# EAGLE design Timer_UNO (EAGLE 6.4)
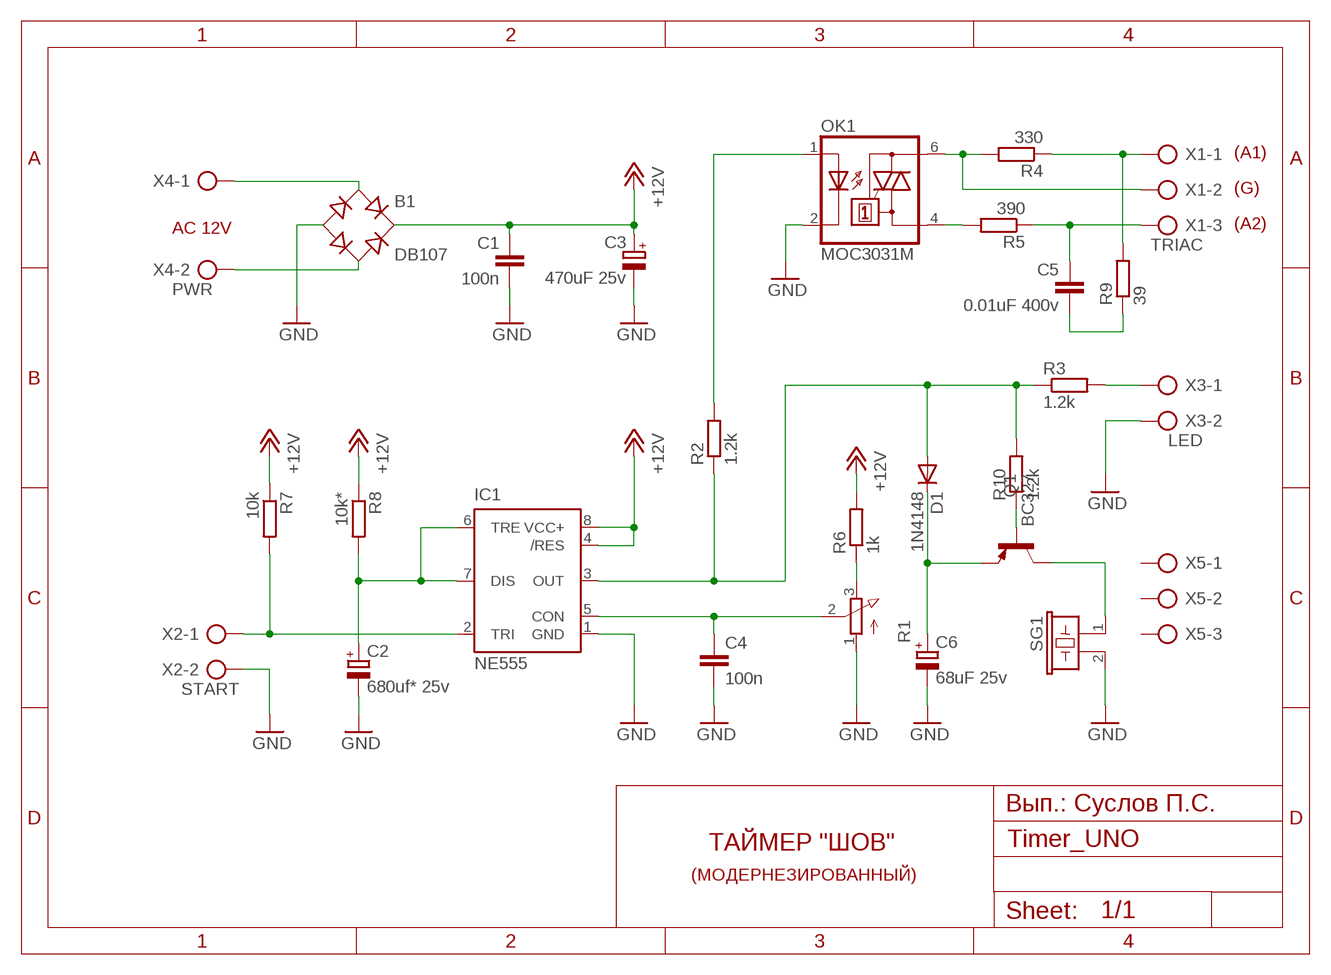
[diagram p0: schematic, sheet 1]

## Parts
B1  DB107  DBDB107G  [DB]
C1  100n  C-EU025-030X050  [C025-030X050]
C2  680uf* 25v  CPOL-EUE3.5-10  [E3,5-10]
C3  470uF 25v  CPOL-EUE3.5-8  [E3,5-8]
C4  100n  C-EU025-030X050  [C025-030X050]
C5  0.01uF 400v  C-EU075-063X106  [C075-063X106]
C6  68uF 25v  CPOL-EUE3.5-8  [E3,5-8]
D1  1N4148  1N4148DO35-7  [DO35-7]
IC1  NE555  [DIL-08]
OK1  MOC3031M  [DIL06]
Q1  BC327  [TO92-EBC]
R1  3RP/1610N  [3RP/1610N]
R2  1.2k  R-EU_0207/10  [0207/10]
R3  1.2k  R-EU_0207/10  [0207/10]
R4  330  R-EU_0207/10  [0207/10]
R5  390  R-EU_0207/10  [0207/10]
R6  1k  R-EU_0207/10  [0207/10]
R7  10k  R-EU_0207/10  [0207/10]
R8  10k*  R-EU_0207/10  [0207/10]
R9  39  R-EU_0411/12  [0411/12]
R10  1.2k  R-EU_0207/10  [0207/10]
SG1  EFBAA40D101  [EFBAA40D101]
X1  TRIAC  AK500/3  [AK500/3]
X2  START  AK500/2  [AK500/2]
X3  LED  AK500/2  [AK500/2]
X4  PWR  AK500/2  [AK500/2]
X5  AK500/3  [AK500/3]

## Nets
+12V: B1.+ C1.1 C3.+ IC1.4(/RES) IC1.8(VCC+) R6.2 R7.1 R8.1
GND: B1.- C1.2 C2.- C3.- C4.2 C6.- IC1.1(GND) OK1.2(C) R1.1(A) SG1.2 X2.2 X3.2
N$1: C4.1 IC1.5(CON) R1.2(S)
N$2: D1.A IC1.3(OUT) R2.1 R3.1 R10.2
N$3: R3.2 X3.1
N$4: OK1.1(A) R2.2
N$5: C5.1 R5.1 X1.3
N$6: OK1.4(A1) R5.2
N$7: OK1.6(A2) R4.2 X1.2
N$8: R4.1 R9.2 X1.1
N$9: R1.3(E) R6.1
N$10: IC1.2(TRI) R7.2 X2.1
N$11: C2.+ IC1.6(TRE) IC1.7(DIS) R8.2
N$12: B1.AC2 X4.2
N$13: B1.AC1 X4.1
N$15: C5.2 R9.1
N$34: C6.+ D1.C Q1.E
N$35: Q1.B R10.1
N$36: Q1.C SG1.1
Unconnected: X5.1 X5.2 X5.3

## Notes on the sheet
- (A1)
- (G)
- AC 12V | (A2)
- Вып.: Суслов П.С.
- ТАЙМЕР "ШОВ"
- (МОДЕРНЕЗИРОВАННЫЙ)

## Library data of the parts
B1 = rectifier:DB?*G: Single Phase 1.0 AMP Glass Passivated Bridge Rectifier Taiwan Semiconductor Co.,Ltd. - TSC Source: http://www.taiwansemi.com/TSCbig5/ezcatfiles/cust/img/img/db101g.pdf http://www.ts.com.tw/db/pictures/modules/PDT/PDT060207001/DBLS201G.pdf
C1 C4 C5 = rcl:C-EU: CAPACITOR, European symbol
C2 C3 C6 = rcl:CPOL-EU: POLARIZED CAPACITOR, European symbol
D1 = diode:1N4148: DIODE high speed (Philips)
IC1 = st-microelectronics:NE555: General purpose bipolar Timer; MF: Arrow Electronics; MPN: NE555N; OC_FARNELL: 1467742; OC_NEWARK: 89K1486
OK1 = optocoupler:MOC30*: 6-Pin DIP Zero-Cross Optoisolators Triac Driver Output (250/400 Volt Peak) Source: Data sheet <http://www.fairchildsemi.com/ds/MO/MOC3031M.pdf> The old path of data sheet not more available 2013-05-06.; MF: FAIRCHILD SEMICONDUCTOR; MPN: MOC3031M; OC_FARNELL: 9875964; OC_NEWARK: 78K6089
Q1 = transistor-pnp:BC327*: PNP Transistror
R1 = pot:3RP/1610N: 16mm Potentiometer one level Source: http://www.alphapotentiometers.net/html/16mm_pot_2.html
R2-R10 = rcl:R-EU_: RESISTOR, European symbol
SG1 = buzzer:EFB?: Piezoelectric Acoustic Transducer Source: Panbasonic .. 2SC1685.pdf; OC_FARNELL: unknown; OC_NEWARK: unknown
X1 X5 = con-ptr500:AK500/3: CONNECTOR; OC_FARNELL: unknown; OC_NEWARK: unknown
X2-X4 = con-ptr500:AK500/2: CONNECTOR; OC_FARNELL: unknown; OC_NEWARK: unknown

## Board
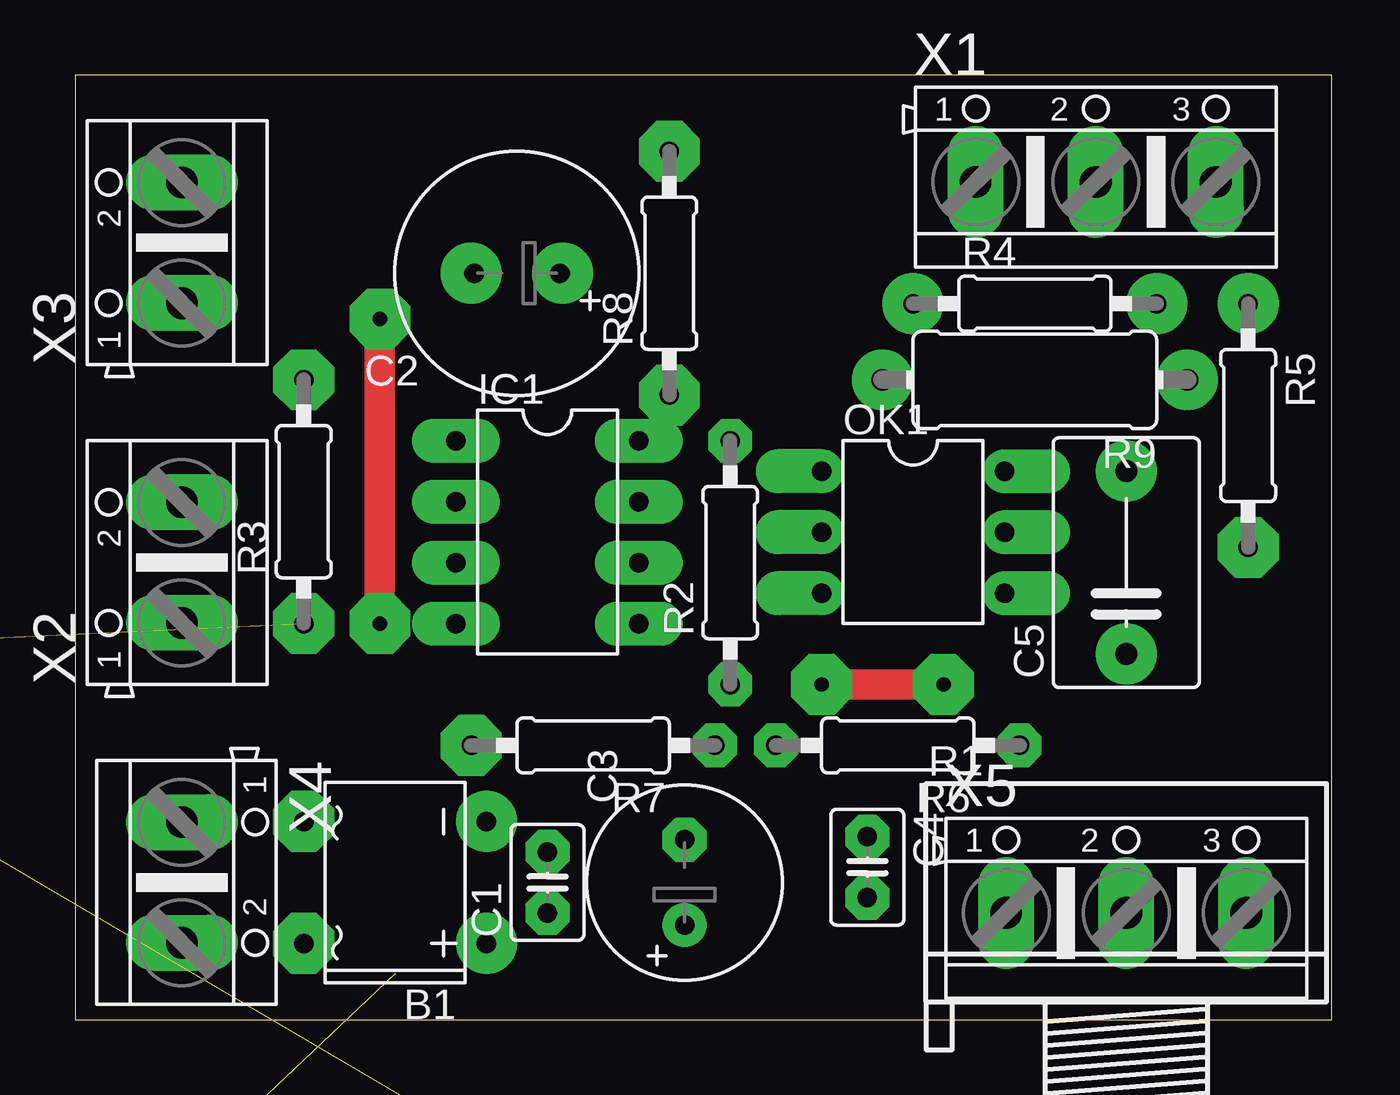
[diagram p1: board, top side]
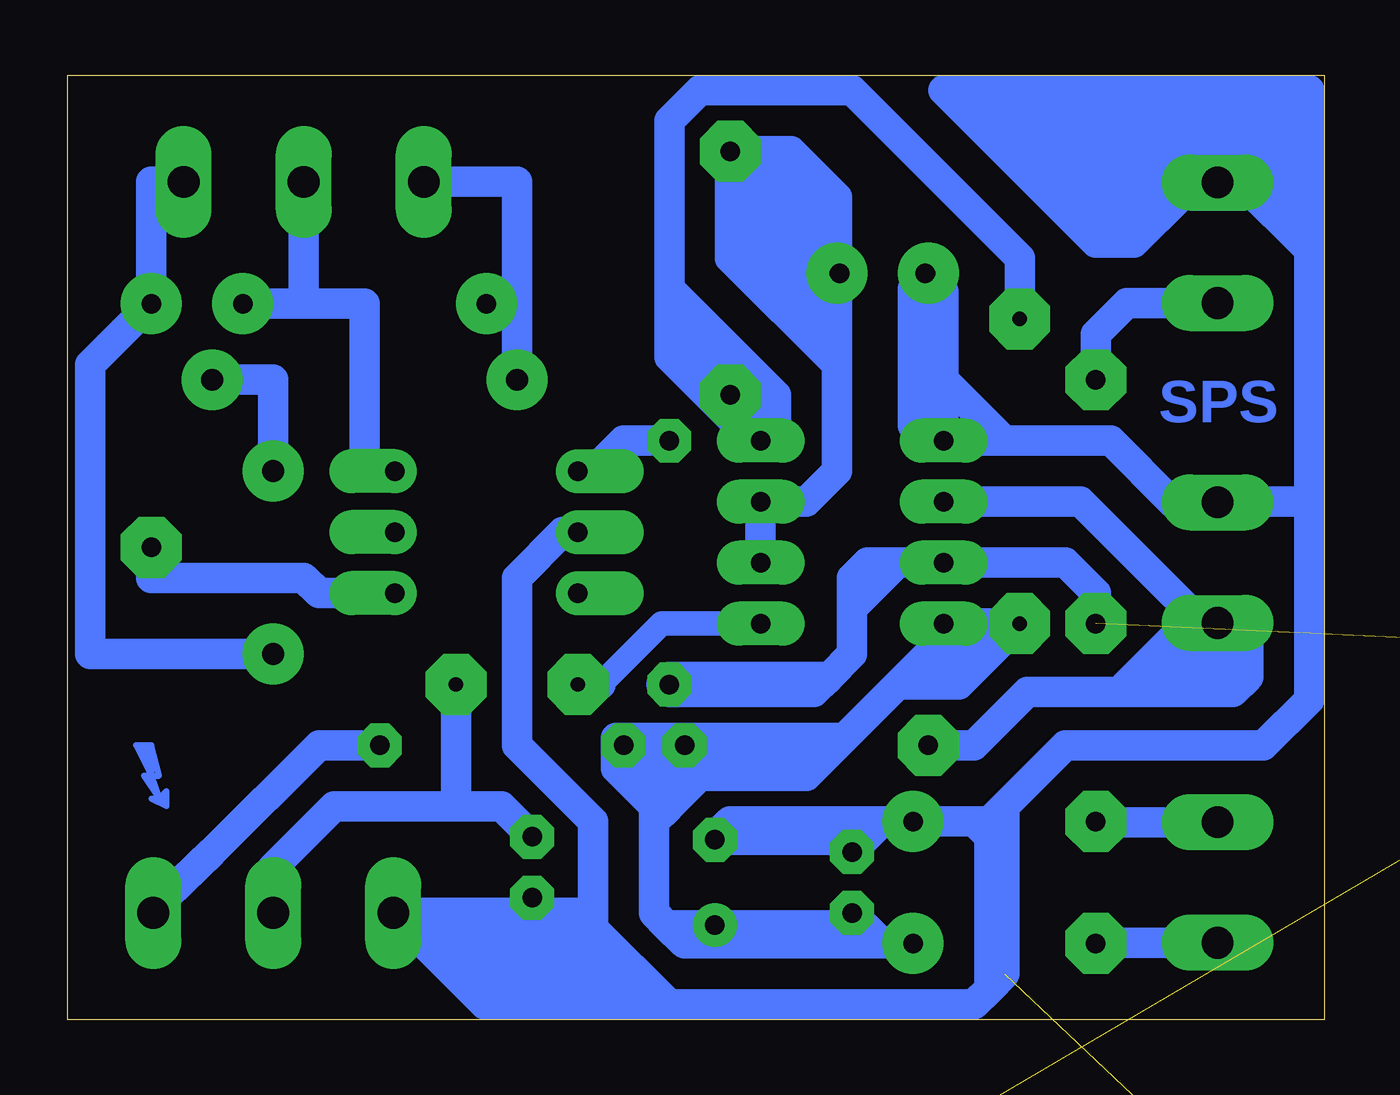
[diagram p2: board, bottom side, seen from below]

Size 52.38 x 39.36 mm. Coordinates in mm from the lower left corner, seen from the top.
Outline: 0,0 52.38,0 52.38,39.36 0,39.36 0,0
Copper layers (1*16): Top 0.035mm / dielectric 1.5mm / Bottom 0.035mm
Design rules "default *": minimum track width 10mil, minimum drill 24mil, track to track 8mil, track to pad 8mil, pad to pad 8mil, via to via 8mil, smd to smd 8mil, copper to edge 40mil, drill to drill 8mil, minimum pad ring 20mil, minimum via ring 8mil, stop-mask expansion 4mil, vias tented up to drill 0mil, thermal gap 10mil
tKeepout: 5 lines

### Footprints (pad centres in the part's own frame; a part is rotated, then mirrored left to right if it is on the bottom)
DB = drill 0.813: + -2.54,-3.81 | drill 0.813 octagon: - 2.54,-3.81; AC1 2.54,3.81; AC2 -2.54,3.81
C025-030X050 = drill 0.813 octagon: 1 -1.27,0; 2 1.27,0
E3,5-10 = drill 0.813 pad 1.6: + -1.778,0 | drill 0.813 pad 1.6 octagon: - 1.778,0
E3,5-8 = drill 0.813 pad 1.6: + -1.778,0 | drill 0.813 pad 1.6 octagon: - 1.778,0
C075-063X106 = drill 0.914 octagon: 1 -3.81,0; 2 3.81,0
DO35-7 = drill 0.813 long: A 3.81,0; C -3.81,0
DIL-08 = drill 0.813 long: 1 -3.81,-3.81; 2 -1.27,-3.81; 3 1.27,-3.81; 4 3.81,-3.81; 5 3.81,3.81; 6 1.27,3.81; 7 -1.27,3.81; 8 -3.81,3.81
DIL06 = drill 0.813 offset: 1 -2.54,-3.81; 2 0,-3.81; 3 2.54,-3.81; 4 2.54,3.81; 5 0,3.81; 6 -2.54,3.81
TO92-EBC = drill 0.813 long: B 0,-1.27; C -2.54,-1.27; E 2.54,-1.27
3RP/1610N = drill 1.2 pad 2.184: 1 -5,0; 2 0,0; 3 5,0
0207/10 = drill 0.813 octagon: 1 -5.08,0; 2 5.08,0
0411/12 = drill 0.914 octagon: 1 -6.35,0; 2 6.35,0
EFBAA40D101 = drill 1.1 pad 1.676: 1 -5,0; 2 5,0
AK500/3 = drill 1.321 long: 1 -5.004,0; 2 0,0; 3 5.004,0
AK500/2 = drill 1.321 long: 1 -2.515,0; 2 2.515,0

### Placement (x,y rotation side)
B1  13.34,5.71 90 top
C1  19.68,5.71 90 top
C2  18.41,31.11 180 top
C3  25.4,5.71 90 top
C4  33.02,6.35 270 top
C5  43.82,19.05 90 top
C6  -2.54,-11.43 0 top  (outside the outline)
D1  18.41,-8.26 0 top  (outside the outline)
IC1  19.68,20.32 270 top
OK1  34.93,20.32 270 top
Q1  -19.05,-2.54 0 top  (outside the outline)
R1  43.82,4.45 0 top
R2  27.3,19.05 90 top
R3  9.53,21.59 90 top
R4  40.01,29.84 0 top
R5  48.9,24.76 270 top
R6  34.29,11.43 180 top
R7  21.59,11.43 180 top
R8  24.76,31.11 90 top
R9  40.01,26.67 180 top
R10  -22.86,15.24 0 top  (outside the outline)
SG1  26.04,-14.61 0 top  (outside the outline)
X1  42.55,34.93 0 top
X2  4.45,19.05 90 top
X3  4.45,32.39 90 top
X4  4.45,5.71 270 top
X5  43.82,4.45 0 top

### Tracks (layer width: path | path; a pad name or v marks a point on that pad's centre or on a via)
+12V  (via drill 0.6 pad 2.54)
  Top 1.27: v12.7,16.51 v12.7,29.21
  Bottom 1.27: 24.76,3.17 B1.+ 18.41,3.17 C1.1 20.19,3.94 C3.+ 27.43,3.94 | 24.76,3.17 25.4,3.81 | 27.43,3.94 27.94,4.45 27.94,8.26 | 26.04,10.16 21.59,10.16 20,11.75 | 20,11.75 17.78,13.97 | 17.78,13.97 15.88,15.88 IC1.4 v12.7,16.51 15.24,13.97 16.51,13.97 | 27.3,8.89 27.94,8.26 | 27.94,8.26 27.94,8.89 | 27.94,8.89 28.89,9.84 | 28.89,9.84 29.21,10.16 | 29.21,10.16 R6.2 R7.1 | 27.3,28.57 R8.1 23.49,26.04 IC1.8 23.49,26.67 27.3,30.48 | 27.3,28.57 27.3,30.48 | 27.3,30.48 27.3,37.47 26.04,38.73 19.68,38.73 12.7,31.75 v12.7,29.21 | 27.94,8.89 27.3,8.89 | 27.3,8.89 26.04,10.16 | 26.04,10.16 26.04,11.75 | 26.04,11.75 29.53,11.75 29.53,10.48 29.21,10.16 | 28.89,9.84 26.99,9.84 26.99,10.48 27.3,10.48 | 28.26,10.48 27.3,10.48 | 27.3,10.48 26.99,10.79 | 26.99,10.79 26.04,11.75 | 26.04,11.75 20.32,11.75 | 20,11.75 20.32,11.75 | 20.32,11.75 21.27,10.79 26.99,10.79 | 24.76,3.17 26.67,3.17 27.43,3.94 | 27.3,28.57 27.3,27.62 23.81,24.13 23.81,25.72 26.67,28.57 25.4,28.57 22.86,26.04 22.86,24.45 23.18,24.45 | 17.78,13.97 16.51,13.97 | 16.51,13.97 14.61,15.88
GND  (via drill 0.6 pad 2.54)  (2 unrouted)
  Bottom 1.27: 18.41,8.26 C1.2 20.19,7.49 C3.- | 18.41,8.26 24.76,8.26 25.4,7.62 | 18.41,8.26 B1.- | B1.- 14.61,8.26 13.97,7.62 13.97,1.27 | 13.97,1.27 14.61,0.64 27.3,0.64 | 28.57,0.64 30.48,0.64 | 30.48,0.64 33.02,0.64 | 33.02,0.64 35.01,0.64 R1.1 | C4.2 33.02,0.64 | B1.- 13.97,8.26 13.34,8.89 | 13.34,8.89 10.79,11.43 2.54,11.43 0.64,13.34 0.64,21.59 | 0.64,21.59 4.42,21.59 X2.2 6.33,21.56 8.89,24.13 13.34,24.13 | X3.2 1.88,34.9 0.64,34.93 | 0.64,34.93 0.64,33.34 | 0.64,32.07 0.64,21.59 | OK1.2 31.75,20.32 33.66,18.41 33.66,11.43 30.48,8.26 30.48,4.45 | 30.48,3.81 30.48,0.64 | C2.- 15.88,30.35 IC1.1 13.34,24.13 | 38.73,4.45 30.48,4.45 | 30.48,4.45 30.48,3.81 | 30.48,3.81 27.3,0.64 | 27.3,0.64 28.57,0.64 | 28.57,0.64 30.8,2.86 30.8,3.17 31.11,3.49 36.51,3.49 | 37.15,3.49 36.51,3.49 | 36.51,3.49 34.29,1.27 31.11,1.27 30.8,1.59 31.43,2.22 34.29,2.22 34.61,2.54 | 16.83,31.11 v16.51,31.11 17.14,30.48 17.14,24.76 16.51,24.13 16.19,24.45 16.19,26.99 13.34,24.13 | 0.64,34.93 0.64,38.73 15.88,38.73 12.06,34.93 | 12.06,34.93 6.35,34.93 | 3.49,34.93 1.27,34.93 1.27,37.78 14.29,37.78 14.61,38.1 13.97,38.1 12.7,36.83 1.91,36.83 1.59,36.51 1.59,35.88 11.75,35.88 12.06,36.2 | 12.06,34.93 9.53,32.39 7.94,32.39 6.03,34.29 10.48,34.29 9.53,33.34 7.94,33.34 6.35,34.93 | 6.35,34.93 3.49,34.93 | 3.49,34.93 0.64,32.07 | 0.64,32.07 0.64,33.34 | 0.64,33.34 1.59,34.29 | 13.97,1.27 13.34,1.91 13.34,8.89
N$1  (via drill 0.6 pad 2.54)
  Top 1.27: v36.2,13.97 v31.11,13.97
  Bottom 1.016: IC1.5 27.62,16.51 30.16,13.97
  Bottom 1.27: R1.2 43.82,6.35 41.27,8.89 36.2,8.89 | 36.2,8.89 34.29,8.89 C4.1 | 36.2,8.89 v36.2,13.97 | v31.11,13.97 30.16,13.97
N$2  (2 unrouted)
  Bottom 1.27: R3.1 9.53,17.78 10.79,19.05 IC1.3 | R2.1 20.95,13.97 | 20.64,14.29 19.68,15.24 19.68,17.14 | 19.68,17.14 19.68,18.41 19.05,19.05 IC1.3 | IC1.3 17.78,19.05 19.68,17.14 | 20.95,13.97 20.64,14.29 | 20.64,14.29 27.3,14.29 27.62,13.97 27.3,13.65 21.27,13.65 20.95,13.97
N$3
  Bottom 1.27: X3.1 8.23,29.87 9.53,28.57 R3.2
N$4
  Bottom 1.27: OK1.1 30.48,22.86 29.21,24.13 R2.2
N$5
  Bottom 1.27: C5.1 51.44,15.24 51.44,27.3 R5.1 48.9,34.93 X1.3
N$6
  Bottom 1.27: R5.2 48.9,18.41 42.55,18.41 41.91,17.78 OK1.4
N$7
  Bottom 1.27: X1.2 42.55,29.84 | 42.55,29.84 R4.2 | OK1.6 40.01,22.86 40.01,29.84 42.55,29.84
N$8
  Bottom 1.27: X1.1 33.66,34.93 33.66,29.84 | 33.66,29.84 R9.2 | R4.1 33.66,29.84
N$9
  Bottom 1.27: R6.1 41.91,11.43 46.36,6.99 48.9,4.53 R1.3
N$10
  Bottom 1.27: R7.2 14.61,11.43 12.38,13.65 6.03,13.65 5.4,13.65 | 4.45,16.51 X2.1 4.47,16.51 5.08,16.51 10.16,21.59 IC1.2 | 4.45,16.51 4.45,14.61 5.4,13.65 | 4.45,16.51 5.71,16.51 8.26,13.97 6.99,13.97 5.71,15.24 5.08,14.61 5.08,15.24 5.71,14.61 | 4.45,16.51 3.17,16.51 3.17,14.29 3.81,13.65 5.4,13.65
N$11
  Bottom 1.27: IC1.6 IC1.7 21.59,21.59 20.32,22.86 20.32,27.3 | 20.32,28.57 20.32,30.99 C2.+ 20.32,31.24 20.32,34.29 22.22,36.2 R8.2 24.76,31.75 20.32,27.3 | 20.32,27.3 20.32,28.57 | 20.32,28.57 24.13,32.39 24.13,35.56 22.86,35.56 20.95,33.66 20.95,30.48 23.49,33.02 23.49,34.29 21.59,32.39 21.59,33.02 23.49,34.93
N$12
  Bottom 1.27: X4.2 9.5,3.2 B1.AC2
N$13
  Bottom 1.27: X4.1 9.5,8.23 B1.AC1
N$14  (via drill 0.6 pad 2.54)
  other vias: 34.93,29.84
N$15
  Bottom 1.27: R9.1 43.82,26.67 C5.2
N$16  (via drill 0.6 pad 2.54)
  other vias: 33.66,26.67
N$17  (via drill 0.6 pad 2.54)
  other vias: 45.09,29.84
N$18  (via drill 0.6 pad 2.54)
  other vias: 48.9,29.84
N$19  (via drill 0.6 pad 2.54)
  other vias: 43.82,22.86
N$20  (via drill 0.6 pad 2.54)
  other vias: 43.82,15.24
N$21  (via drill 0.6 pad 2.54)
  other vias: 48.9,19.68
N$22  (via drill 0.6 pad 2.54)
  other vias: 46.36,26.67
N$23  (via drill 0.6 pad 2.54)
  other vias: 9.53,8.26
N$24  (via drill 0.6 pad 2.54)
  other vias: 9.53,3.17
N$25  (via drill 0.6 pad 2.54)
  other vias: 17.14,8.26
N$26  (via drill 0.6 pad 2.54)
  other vias: 17.14,3.17
N$27
  Bottom 0.254: 49.21,11.43 49.53,11.43 | 49.53,11.43 48.9,10.16 | 48.9,10.16 49.21,10.16 48.58,9.21 | 48.58,9.21 48.9,9.21 48.26,8.89 48.26,9.21 | 48.26,9.21 48.26,9.53 48.58,9.21 | 48.9,10.48 48.9,10.79 | 48.9,10.79 48.9,11.43 | 48.9,10.16 48.58,10.16 48.9,11.43 | 48.9,11.43 49.21,11.43 | 49.21,11.43 48.9,10.79 | 48.9,10.79 49.53,11.43 | 49.53,11.43 48.9,10.48 | 48.9,10.48 48.9,10.16 | 48.9,10.16 48.58,9.21 | 48.58,9.21 48.26,9.21
N$28  (via drill 0.6 pad 2.54)
  other vias: 9.53,16.51
N$29  (via drill 0.6 pad 2.54)
  other vias: 20.32,31.11
N$30  (via drill 0.6 pad 2.54)
  other vias: 24.76,36.2
N$31  (via drill 0.6 pad 2.54)
  other vias: 24.76,26.04
N$32  (via drill 0.6 pad 2.54)
  other vias: 9.53,26.67
N$33  (via drill 0.6 pad 2.54)
  other vias: 16.51,11.43
N$34  (2 unrouted)
N$35  (1 unrouted)
N$36  (1 unrouted)

### Text on the board
Bottom: SPS